# EAGLE design syringe_pump (EAGLE 9.3.2)
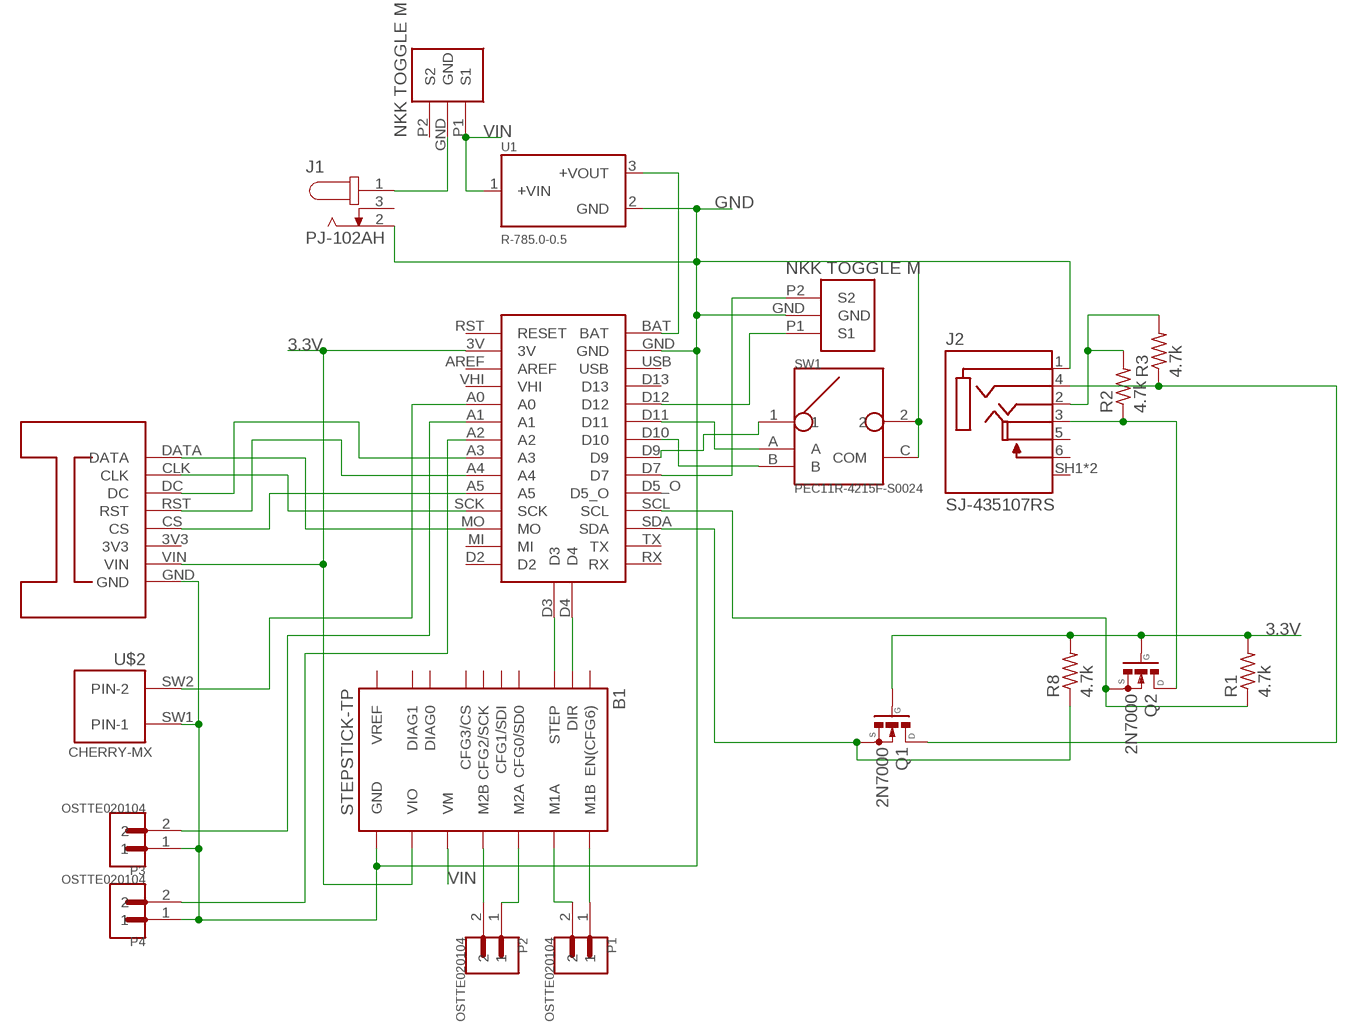
[diagram p0: schematic, sheet 1]

## Parts
B1  STEPSTICK-TP  [STEPSTICK_TP]
J1  PJ-102AH  [CUI_PJ-102AH]
J2  SJ-435107RS  [CUI_SJ-435107RS]
P1  OSTTE020104  [OST_OSTTE020104]
P2  OSTTE020104  [OST_OSTTE020104]
P3  OSTTE020104  [OST_OSTTE020104]
P4  OSTTE020104  [OST_OSTTE020104]
Q1  2N7000  [TO92]
Q2  2N7000  [TO92]
R1  4.7k  R-US_0207/10  [0207/10]
R2  4.7k  R-US_0207/10  [0207/10]
R3  4.7k  R-US_0207/10  [0207/10]
R8  4.7k  R-US_0207/10  [0207/10]
SW1  PEC11R-4215F-S0024  [SW_PEC11R-4215F-S0024]
U1  R-785.0-0.5  [RECOM_R-785.0-0.5]
U$1  ITSYBITSYM4  [ITSYBITSYM4]
U$2  CHERRY-MX  [CHERRY-MX]
U$3  OLED_128X64  [OLED_128X64]
U$4  NKK_M2012S2A2A30  [NKK_M2012S2A2A30]
U$5  NKK_B13AH  [NKK_B13AH]

## Nets
3.3V: B1.VIO Q1.2(G) Q2.2(G) R1.2 R8.2 U$1.3V U$3.VIN
GND: B1.GND@1(GND) B1.GND@2(GND) J1.2 J2.1(SLEEVE) P3.1 P4.1 SW1.2 SW1.C(COM) U1.2(GND) U$1.GND U$2.SW1(PIN-1) U$3.GND U$5.GND
N$1: Q1.1(S) R8.1 U$1.SDA
N$2: J2.2(TIP) R2.2 R3.2
N$3: B1.STEP U$1.D3
N$4: B1.DIR U$1.D4
N$5: Q2.1(S) R1.1 U$1.SCL
N$6: B1.M2B P2.2
N$7: B1.M2A P2.1
N$8: B1.M1B P1.1
N$9: B1.M1A P1.2
N$10: J2.3(RING1) Q2.3(D) R2.1
N$11: J2.4(RING2) Q1.3(D) R3.1
N$12: U$1.MO U$3.DATA
N$13: U$1.A3 U$3.DC
N$14: U$1.A5 U$3.CS
N$15: U$1.A4 U$3.RST
N$16: P4.2 U$1.A2
N$17: U$1.SCK U$3.CLK
N$18: J1.1 U$4.GND
N$19: P3.2 U$1.A1
N$20: U$1.A0 U$2.SW2(PIN-2)
N$21: U$1.D12 U$5.P1(S1)
N$22: U$1.D7 U$5.P2(S2)
N$23: SW1.A U$1.D11
N$24: SW1.B U$1.D10
N$25: SW1.1 U$1.D9
N$26: U1.3(+VOUT) U$1.BAT
VIN: B1.VM U1.1(+VIN) U$4.P1(S1)
Unconnected: B1.CFG1(CFG1/SDI) B1.CFG2(CFG2/SCK) B1.CFG3(CFG3/CS) B1.DIAG0 B1.DIAG1 B1.EN(EN(CFG6)) B1.NC/CFG0(CFG0/SD0) B1.VREF J1.3 J2.5(ISOLATED_RING1) J2.6(ISOLATED_RING1_SWITCH(N-O)) J2.SH1(SHIELD) J2.SH2(SHIELD) U$1.AREF U$1.D2 U$1.D5_O U$1.D13 U$1.MI U$1.RST(RESET) U$1.RX U$1.TX U$1.USB U$1.VHI U$3.3V3 U$4.P2(S2)

## Library data of the parts
B1 = we-board:STEPSTICK: SilentStepStick - Trinamic TMC2100/TMC2130 Stepper Motor Driver TMC2100 - CFG pins for configuration TMC2130 - SPI for configuration Pin CFG0/SDO only available on TMC2130 SilentStepStick.
J1 = PJ-102AH:PJ-102AH: 2.0 mm Center Pin, 5.0 A, Right Angle, Through Hole, Tapered Pins, Dc Power Jack Connector; MANUFACTURER: CUI INC; PART_REV: 1.02; STANDARD: Manufacturer recommendations
J2 = SJ-435107RS:SJ-435107RS: 3.5 mm Right Angle Shielded (0.141", 1/8", Mini Plug) Female HeadPhone Jack; AVAILABILITY: Good; DESCRIPTION: 3.5 mm Right Angle Shielded _0.141, 1/8, Mini Plug_ Female HeadPhone Jack; MF: CUI; MP: SJ-435107RS; PACKAGE: None; PRICE: 1.04 USD
P1-P4 = OSTTE020104:OSTTE020104: Terminal Block 3.5mm 2pos Pcb; DESCRIPTION: Terminal Block 3.5mm 2pos Pcb; DIGI-KEY_PART_NUMBER: ED2740-ND; DIGI-KEY_PURCHASE_URL: https://www.digikey.com/product-detail/en/on-shore-technology-inc/OSTTE020104/ED2740-ND/2351816?utm_source=snapeda&utm_medium=aggregator&utm_campaign=symbol; MF: On Shore; MP: OSTTE020104; PACKAGE: None
Q1 Q2 = 2N7000:2N7000: N-Channel Mosfet [S]-G-D pinout 2n7000: http://smallbear-electronics.mybigcommerce.com/transistor-fet-2n7000/; AVAILABILITY: Unavailable; DESCRIPTION: MOSFETs- Power and Small Signal 60V 200mA N-Channel No-Cancel/No-Return; MF: STMicroelectronics; MP: 2N7000; PACKAGE: TO-92 ON Semiconductor; PRICE: None
R1-R3 R8 = rcl:R-US_: RESISTOR, American symbol; SPICEPREFIX: R
SW1 = PEC11R-4215F-S0024:PEC11R-4215F-S0024: Incremental Encoder, 12 Mm, Contact Rating 10 Ma - 5 Vdc; AVAILABILITY: Unavailable; DESCRIPTION: Incremental Encoder, 12 Mm, Contact Rating 10 Ma - 5 Vdc; MF: Bourns; MP: PEC11R-4215F-S0024; PACKAGE: None; PRICE: None
U1 = R-785.0-0.5:R-785.0-0.5: Switching Regulator, 0.5 Amp, Sip 3, 5vsingle Output, High Efficiency; DESCRIPTION: Switching Regulator, 0.5 Amp, Sip 3, 5vsingle Output, High Efficiency; DIGI-KEY_PART_NUMBER: 945-1037-ND; DIGI-KEY_PURCHASE_URL: https://www.digikey.com/product-detail/en/recom-power/R-785.0-0.5/945-1037-ND/2256217?utm_source=snapeda&utm_medium=aggregator&utm_campaign=symbol; MF: Recom Power; MP: R-785.0-0.5; PACKAGE: SIP-3 Recom Power
U$1 = arthur:ITSYBITSYM4
U$2 = cherrymx:CHERRY-MX: Cherry MX series keyswitch
U$3 = arthur:OLED_128X64
U$4 = arthur:NKK_M2012S2A2A30
U$5 = arthur:NKK_B13AH

## Board
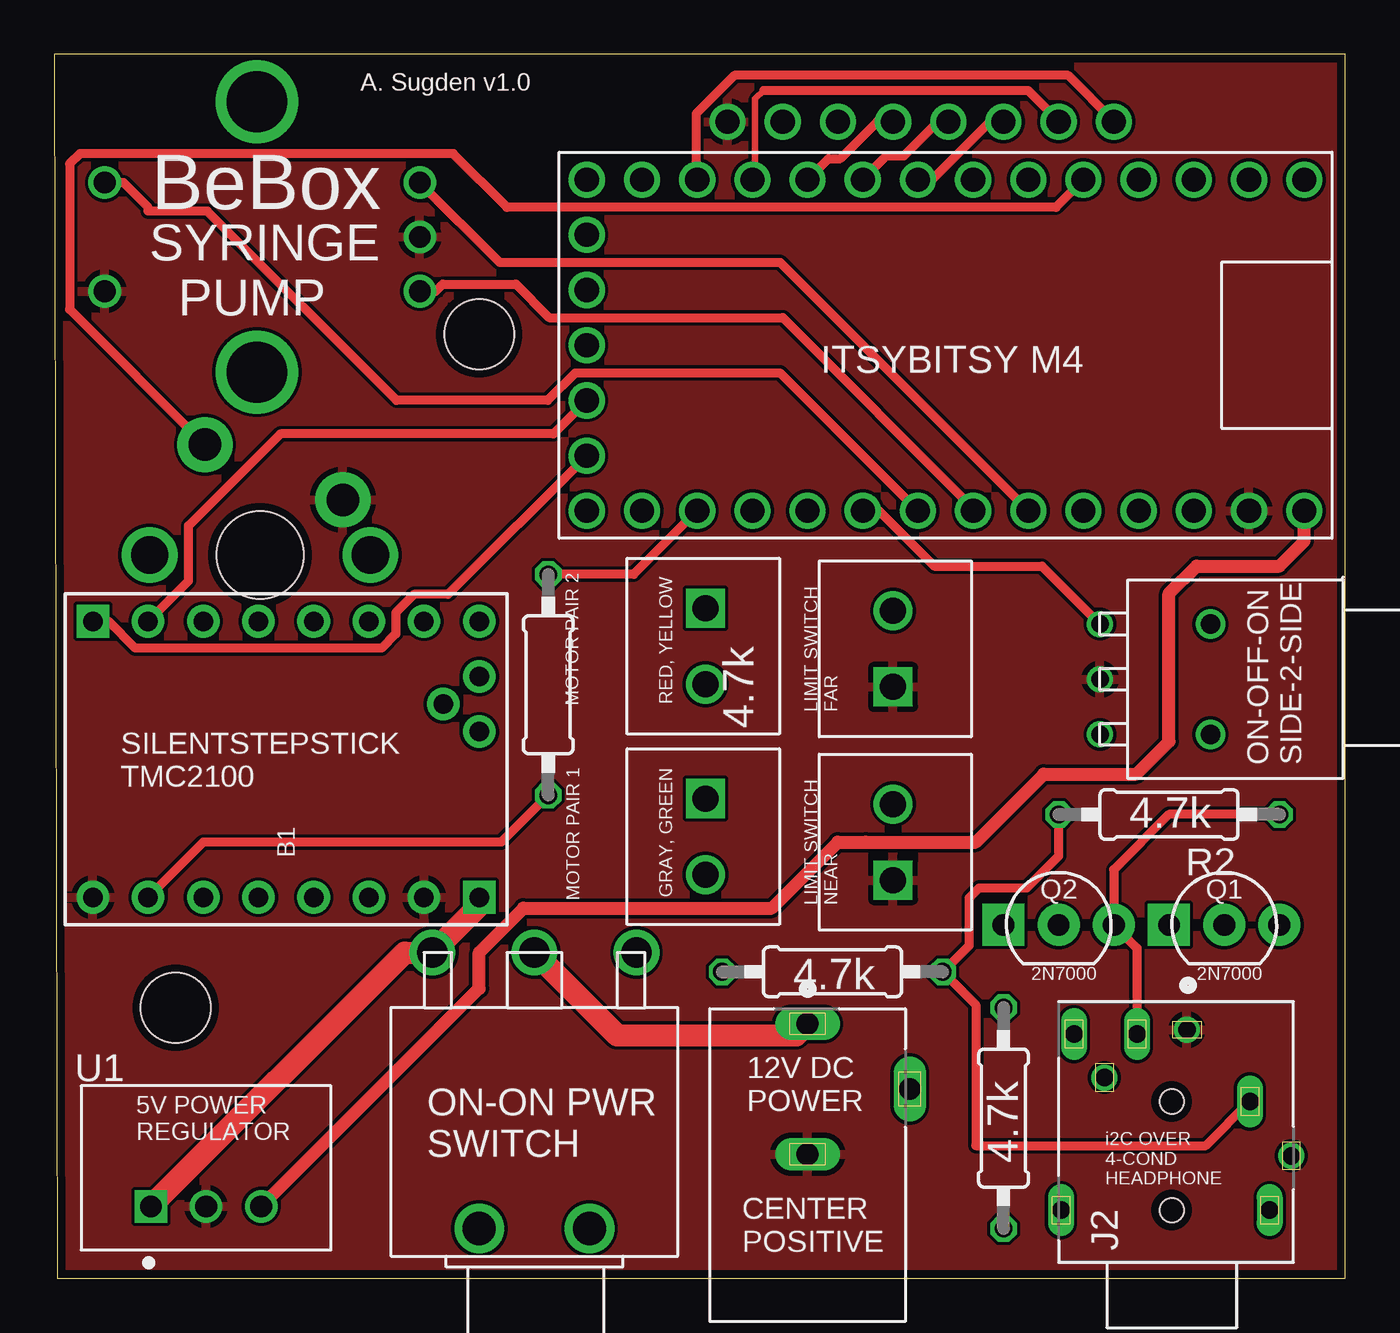
[diagram p1: board, top side]
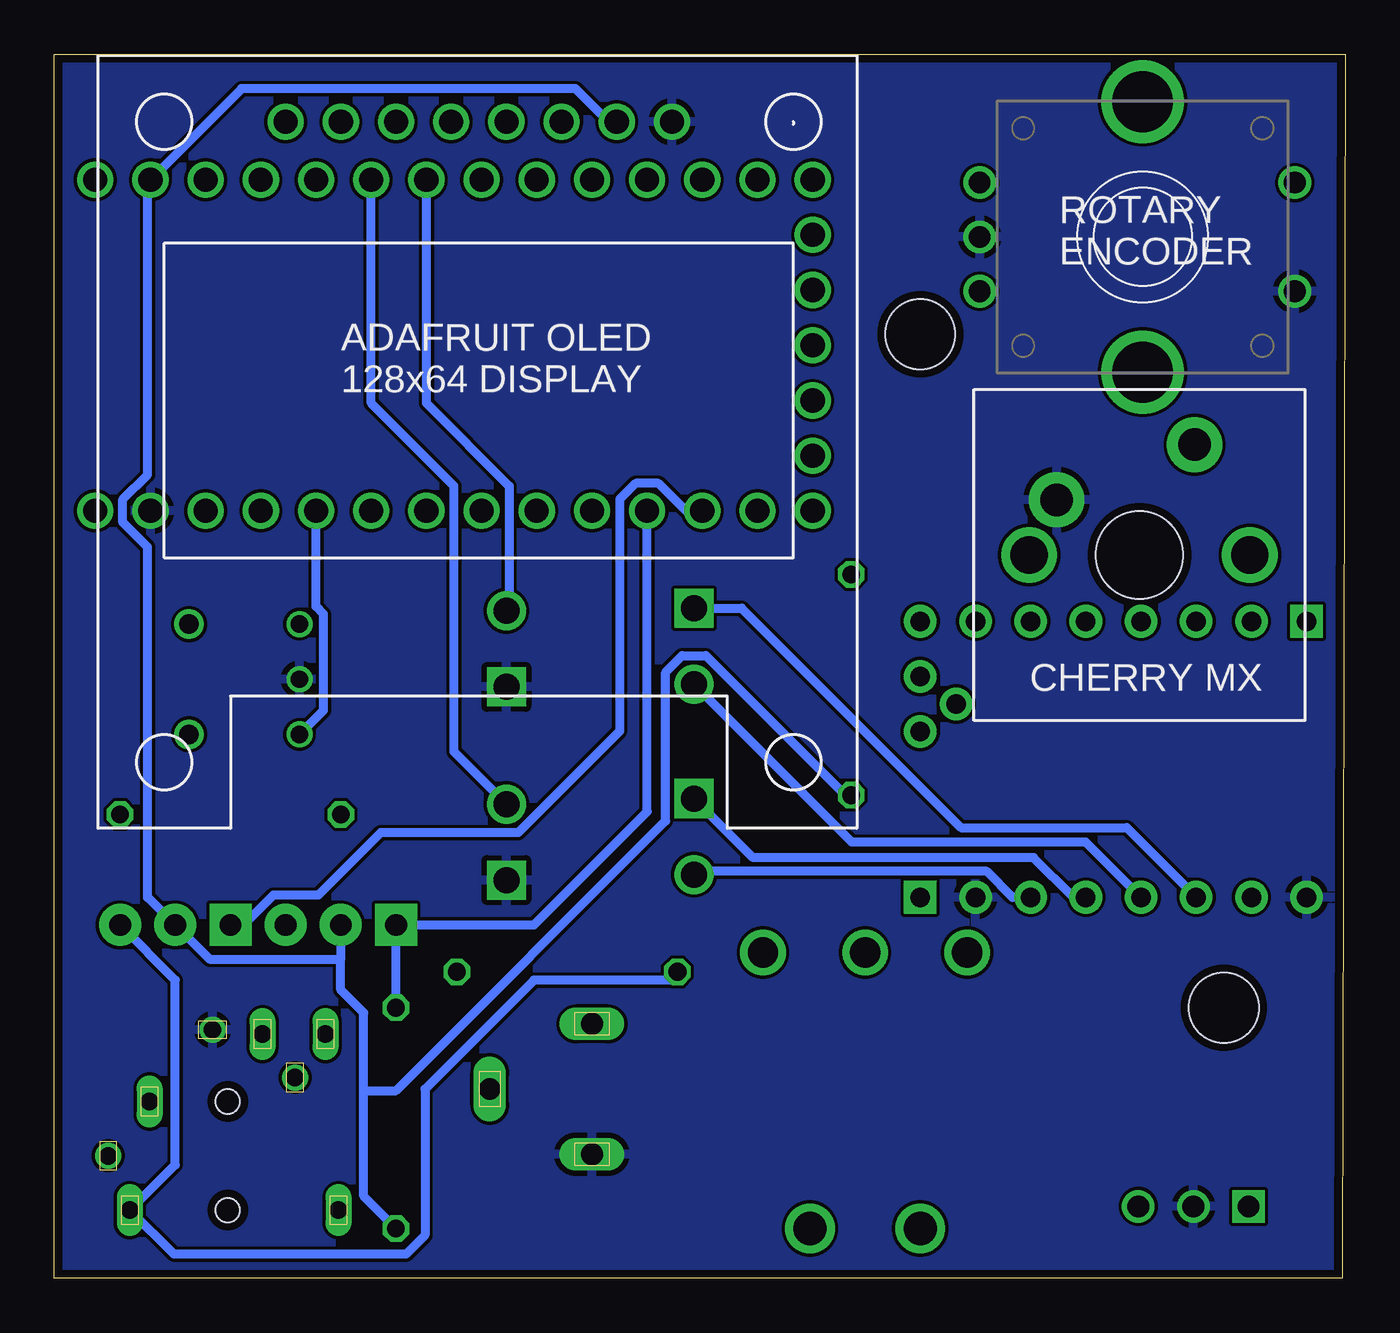
[diagram p2: board, bottom side, seen from below]

Size 59.42 x 56.31 mm. Coordinates in mm from the lower left corner, seen from the top.
Outline: 0.13,0 59.42,0 59.42,56.31 0,56.31 0.13,0
Copper layers (1*16): Top 0.035559375mm / dielectric 1.6mm / Bottom 0.035559375mm
Design rules "oshpark-2layer": minimum track width 6mil, minimum drill 10mil, track to track 6mil, track to pad 6mil, pad to pad 6mil, via to via 6mil, smd to smd 6mil, copper to edge 15mil, drill to drill 6mil, minimum pad ring 5mil, minimum via ring 5mil, stop-mask expansion 2.5mil, vias tented up to drill 0mil, thermal gap 10mil
Holes 3.2 mm at 5.59,12.45 19.56,43.43

### Footprints (pad centres in the part's own frame; a part is rotated, then mirrored left to right if it is on the bottom)
STEPSTICK_TP = drill 0.9 pad 1.5: CFG1 -6.35,6.35; CFG2 -6.35,3.81; CFG3 -6.35,1.27; DIAG0 -2.54,7.239; DIAG1 -1.27,8.89; EN -6.35,8.89; GND@1 6.35,6.35; GND@2 6.35,-8.89; M1A 6.35,-1.27; M1B 6.35,-3.81; M2A 6.35,1.27; M2B 6.35,3.81; NC -6.35,-3.81; NC/CFG0 -6.35,-1.27; STEP -6.35,-6.35; VIO 6.35,-6.35; VREF -3.81,8.89 | drill 0.9 pad 1.5 square: DIR -6.35,-8.89; VM 6.35,8.89
CUI_PJ-102AH = drill 1 long: 1 -6.5,0; 2 -0.5,0; 3 -3.5,4.7
CUI_SJ-435107RS = drill 0.8 pad 1.1: 1 4.7,-0.7; 5 2.5,3.1; SH2 -1.1,-5.5 | drill 0.8 pad 1.1 long: 2 1.4,-3.6; 3 4.5,1.6; 4 -3.6,-4.5; 6 4.5,4.5; SH1 -3.6,5.1 | hole 1.1: -3.6,0; 1.4,0
OST_OSTTE020104 = drill 1.2 square: 1 -1.75,0 | drill 1.2: 2 1.75,0
TO92 = drill 1 pad 1.93 square: 1 -2.54,0 | drill 1 pad 1.93: 2 0,0; 3 2.54,0
0207/10 = drill 0.813 octagon: 1 -5.08,0; 2 5.08,0
SW_PEC11R-4215F-S0024 = drill 1: 1 -2.5,7; 2 2.5,7; A -2.5,-7.5; B 2.5,-7.5; C 0,-7.5 | drill 2.794: P$1 -6.223,0; P$2 6.223,0
RECOM_R-785.0-0.5 = drill 1 square: 1 -2.54,-1.775 | drill 1: 2 0,-1.775; 3 2.54,-1.775
ITSYBITSYM4 = drill 1.11: 3V -12.7,-7.62; A0 -5.08,-7.62; A1 -2.54,-7.62; A2 0,-7.62; A3 2.54,-7.62; A4 5.08,-7.62; A5 7.62,-7.62; AREF -10.16,-7.62; BAT -15.24,7.62; D2 17.78,-7.62; D3 17.78,2.54; D4 17.78,5.08; D5_O 7.62,7.62; D7 5.08,7.62; D9 2.54,7.62; D10 0,7.62; D11 -2.54,7.62; D12 -5.08,7.62; D13 -7.62,7.62; GND -12.7,7.62; MI 15.24,-7.62; MO 12.7,-7.62; P$1 17.78,0; P$3 17.78,-2.54; P$4 17.78,-5.08; RST -15.24,-7.62; RX 17.78,7.62; SCK 10.16,-7.62; SCL 10.16,7.62; SDA 12.7,7.62; TX 15.24,7.62; USB -10.16,7.62; VHI -7.62,-7.62
CHERRY-MX = drill 1.714 pad 1.93: P$3 -5.08,0; P$4 5.08,0 | drill 1.5 pad 2.54: SW1 -3.81,2.54; SW2 2.54,5.08 | hole 4: 0,0
OLED_128X64 = drill 1.11: 3V3 3.81,13.716; CLK -6.35,13.716; CS 1.27,13.716; DATA -8.89,13.716; DC -3.81,13.716; GND 8.89,13.716; RST -1.27,13.716; VIN 6.35,13.716
NKK_M2012S2A2A30 = drill 1.397: GND 0,12.7; P1 -4.699,12.7; P2 4.699,12.7 | drill 1.524: P$1 -2.54,0; P$2 2.54,0
NKK_B13AH = drill 0.8: GND 0,5.08; P1 -2.54,5.08; P2 2.54,5.08 | drill 0.9: P$1 -2.54,0; P$2 2.54,0

### Placement (x,y rotation side)
B1  10.67,23.88 270 top
J1  34.67,5.21 270 top
J2  51.44,6.73 90 top
P1  29.97,29.08 270 top
P2  29.97,20.32 270 top
P3  38.61,20.07 90 top
P4  38.61,28.96 90 top
Q1  53.85,16.26 0 top
Q2  46.23,16.26 0 top
R1  43.69,7.37 270 top
R2  51.31,21.34 180 top
R3  35.81,14.1 0 top
R8  22.73,27.3 270 top
SW1  9.32,47.91 270 bottom
U1  6.99,5.08 0 top
U$1  42.29,42.93 180 top
U$2  9.47,33.27 0 bottom
U$3  39.88,39.5 0 bottom
U$4  22.1,2.29 0 top
U$5  53.21,27.56 90 top

### Tracks (layer width: path | path; a pad name or v marks a point on that pad's centre or on a via)
3.3V
  Top 0.406: R8.2 20.57,20.07 6.86,20.07 B1.VIO
  Bottom 0.406: R1.2 45.18,3.78 45.18,8.64 | 46.23,14.68 46.23,13.26 45.18,12.21 45.18,8.64 | 46.23,14.68 52.27,14.68 Q1.2 55.12,17.53 55.12,33.64 56.26,34.78 56.26,35.83 55.12,36.97 55.12,50.42 U$1.3V 50.8,54.74 35.43,54.74 33.91,53.21 U$3.VIN | Q2.2 46.23,14.68 | 45.18,8.64 43.69,8.64 31.28,21.04 31.28,27.88 30.52,28.64 29.43,28.64 23.01,22.22 R8.2
GND
  pour Bottom: -4.57,56.9 -4.57,-1.52 61.47,-1.52 61.47,58.17 -3.3,58.17
  pour Top: -4.57,58.17 -4.57,-1.52 61.47,-1.52 61.47,58.17
N$1
  Top 0.406: U$1.SDA 26.67,32.39 R8.1
  Bottom 0.406: Q1.1 50.71,16.26 49.34,17.63 47.27,17.63 44.39,20.5 38.06,20.5 33.4,25.17 33.4,35.83 32.66,36.57 31.61,36.57 30.34,35.31 U$1.SDA
N$2
  Top 0.406: R2.2 46.23,19.43 44.76,17.96 42.58,17.96 42.11,17.49 42.11,15.32 R3.2 42.42,12.57 42.42,6.1 53,6.1 J2.2
N$3
  Top 0.406: B1.STEP 6.18,32.09 6.18,34.62 10.41,38.85 22.98,38.85 U$1.D3
N$4
  Top 0.406: U$1.D4 18.12,31.46 16.56,31.46 15.71,30.61 15.71,29.64 15.06,28.99 3.73,28.99 2.5,30.23 B1.DIR
N$5
  Bottom 0.406: R1.1 Q2.1 37.34,16.26 32.13,21.46 U$1.SCL
N$6
  Bottom 0.406: B1.M2B 15.31,17.53 16.5,18.72 29.82,18.72 P2.2
N$7
  Bottom 0.406: B1.M2A 12.52,17.53 14.35,19.36 27.26,19.36 P2.1
N$8
  Bottom 0.406: P1.1 27.79,30.83 17.68,20.73 10.06,20.73 B1.M1B
N$9
  Bottom 0.406: B1.M1A 11.94,20.07 22.71,20.07 P1.2
N$10
  Top 0.406: J2.3 49.84,15.19 Q2.3 48.77,18.8 51.31,21.34 R2.1
N$11
  Bottom 0.406: R3.1 31.12,13.72 37.34,13.72 42.35,8.7 42.35,1.98 43.23,1.1 53.91,1.1 J2.4 53.85,5.22 53.85,13.72 Q1.3
N$12
  Top 0.406: U$1.MO 29.55,50.59 29.55,53.58 31.31,55.34 46.67,55.34 48.77,53.24 U$3.DATA
N$13
  Top 0.406: U$1.A3 40.39,50.55 43.05,53.21 U$3.DC
N$14
  Top 0.406: U$1.A5 35.64,51.52 36.18,51.52 37.88,53.21 U$3.CS
N$15
  Top 0.406: U$1.A4 38.31,51.64 39.1,51.64 40.67,53.21 U$3.RST
N$16
  Bottom 0.406: P4.2 38.48,30.83 38.48,36.45 42.29,40.26 U$1.A2
N$17
  Top 0.305: 32.66,54.66 32.26,54.26 32.26,50.67 U$1.SCK
  Top 0.406: U$3.CLK 46.23,53.24 44.81,54.66 32.66,54.66
N$18
  Top 1.016: U$4.GND 25.91,11.18 34.14,11.18 J1.1
N$19
  Bottom 0.406: P3.2 41.02,24.23 41.02,36.45 44.83,40.26 U$1.A1
N$20
  Top 0.406: U$1.A0 46.1,49.28 20.83,49.28 18.36,51.75 1.18,51.75 0.7,51.27 0.7,44.58 U$2.SW2
N$21
  Bottom 0.406: U$1.D12 47.37,30.91 47.02,30.56 47.02,26.13 U$5.P1
N$22
  Top 0.406: U$1.D7 37.96,35.31 40.5,32.77 45.47,32.77 U$5.P2
N$23
  Top 0.406: SW1.A 20.5,46.74 33.4,46.74 U$1.D11
N$24
  Top 0.406: SW1.B 17.55,45.41 17.87,45.73 21.24,45.73 22.78,44.2 33.53,44.2 42.29,35.43 U$1.D10
N$25
  Top 0.406: U$1.D9 33.4,41.66 23.99,41.66 22.71,40.39 15.75,40.39 7.04,49.09 4.32,49.09 4.32,49.28 3.19,50.41 SW1.1
N$26
  Top 0.61: U1.3 19.56,13.34 19.56,14.99 21.59,17.02 33.02,17.02 36.07,20.07 37.34,20.07 42.42,20.07 45.54,23.19 49.8,23.19 51.31,24.69 51.31,31.5 52.58,32.77 56.39,32.77 57.53,33.91 U$1.BAT
VIN
  Top 1.016: B1.VM 19.56,17.14 U$4.P1 16.13,14.99 U1.1

### Text on the board
tPlace: A. Sugden v1.0 | BeBox | SYRINGE / PUMP | MOTOR PAIR 2 | RED, YELLOW | 4.7k | LIMIT SWITCH / FAR | SILENTSTEPSTICK / TMC2100 | 4.7k | MOTOR PAIR 1 | GRAY, GREEN | LIMIT SWITCH / NEAR | 4.7k | 2N7000 | 2N7000 | 12V DC / POWER | 5V POWER / REGULATOR | 4.7k | i2C OVER / 4-COND / HEADPHONE | CENTER / POSITIVE
bPlace: ROTARY / ENCODER | CHERRY MX